# Altium schematic sheet TSMP-Resistors.SchDoc
size A; SheetNumber: 4; SheetTotal: 8
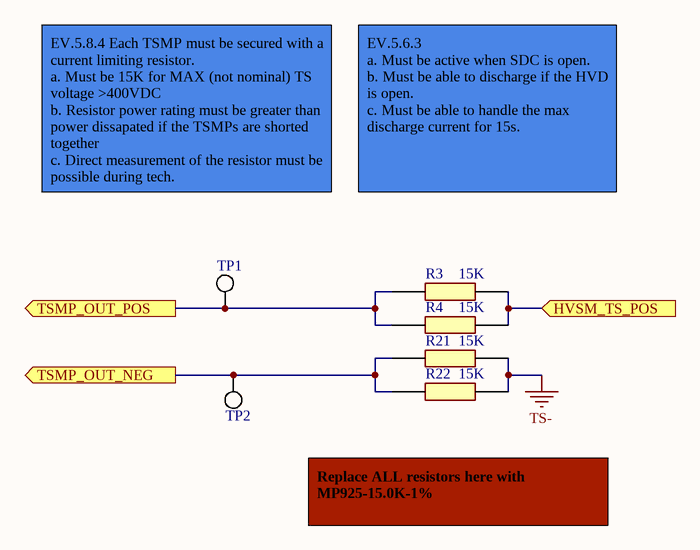
[diagram p0: TSMP-Resistors.SchDoc]

## Parts
R3  15K  [TO508P344X1041X2058-2P]
R4  15K  [TO508P344X1041X2058-2P]
R21  15K  [TO508P344X1041X2058-2P]
R22  15K  [TO508P344X1041X2058-2P]
TP1  (no value)  [FOOTPRINT-GENERIC-TP-VIA-1MM]
TP2  (no value)  [FOOTPRINT-GENERIC-TP-VIA-1MM]

## Ports
HVSM_TS_POS (in, see Top_Level[1C], HV-Connectors[2B], HV-Trigger[1A]), TSMP_OUT_NEG (out, see Top_Level[1C], HV-Connectors[3B]), TSMP_OUT_POS (out, see Top_Level[1C], HV-Connectors[3B])

## Nets
TS-: R21.2 R22.2
HVSM_TS_POS: R3.2 R4.2 ; port HVSM_TS_POS
TSMP_OUT_NEG: R21.1 R22.1 TP2.1(TP) ; port TSMP_OUT_NEG
TSMP_OUT_POS: R3.1 R4.1 TP1.1(TP) ; port TSMP_OUT_POS

## Notes on the sheet
- EV.5.8.4 Each TSMP must be secured with a current limiting resistor.
  a. Must be 15K for MAX (not nominal) TS voltage >400VDC
  b. Resistor power rating must be greater than power dissapated if the TSMPs are shorted together
  c. Direct measurement of the resistor must be possible during tech.
- EV.5.6.3
  a. Must be active when SDC is open.
  b. Must be able to discharge if the HVD is open.
  c. Must be able to handle the max discharge current for 15s.
- Replace ALL resistors here with MP925-15.0K-1%

## Library data of the parts
R3 R4 R21 R22 = MP925-15.0K-1%: Thick Film Resistors - Through Hole 15K ohm 25W 1% TO-220 PKG PWR FILM; Manufacturer_Name: Caddock; Geometry.Height: 3.44mm; Mouser Part Number: 684-MP925-15K; Mouser Price/Stock: https://www.mouser.co.uk/ProductDetail/Caddock/MP925-15.0K-1?qs=3xGhc7tteJWFgUsHgFGqHw%3D%3D; Manufacturer_Part_Number: MP925-15.0K-1%; Datasheet Link: http://www.caddock.com/Online_catalog/Mrktg_Lit/MP9000_Series.pdf; Supplier 1: Digikey; Supplier Part Number 1: MP925-15.0KF-ND
TP1 TP2 = CMP-025-000000-1: Source: Generic.SchLib; Design Item ID: Misc-Generic-TP